# Altium schematic sheet Peripherals.SchDoc
size A3; Author: Ali Zoubir; Organization: ETML-ES; Address1: Avenue Recordon 1; Address2: 1004 Lausanne; Address3: Switzerland; Revision: 1924B; SheetNumber: 3; SheetTotal: 4; Version: V0
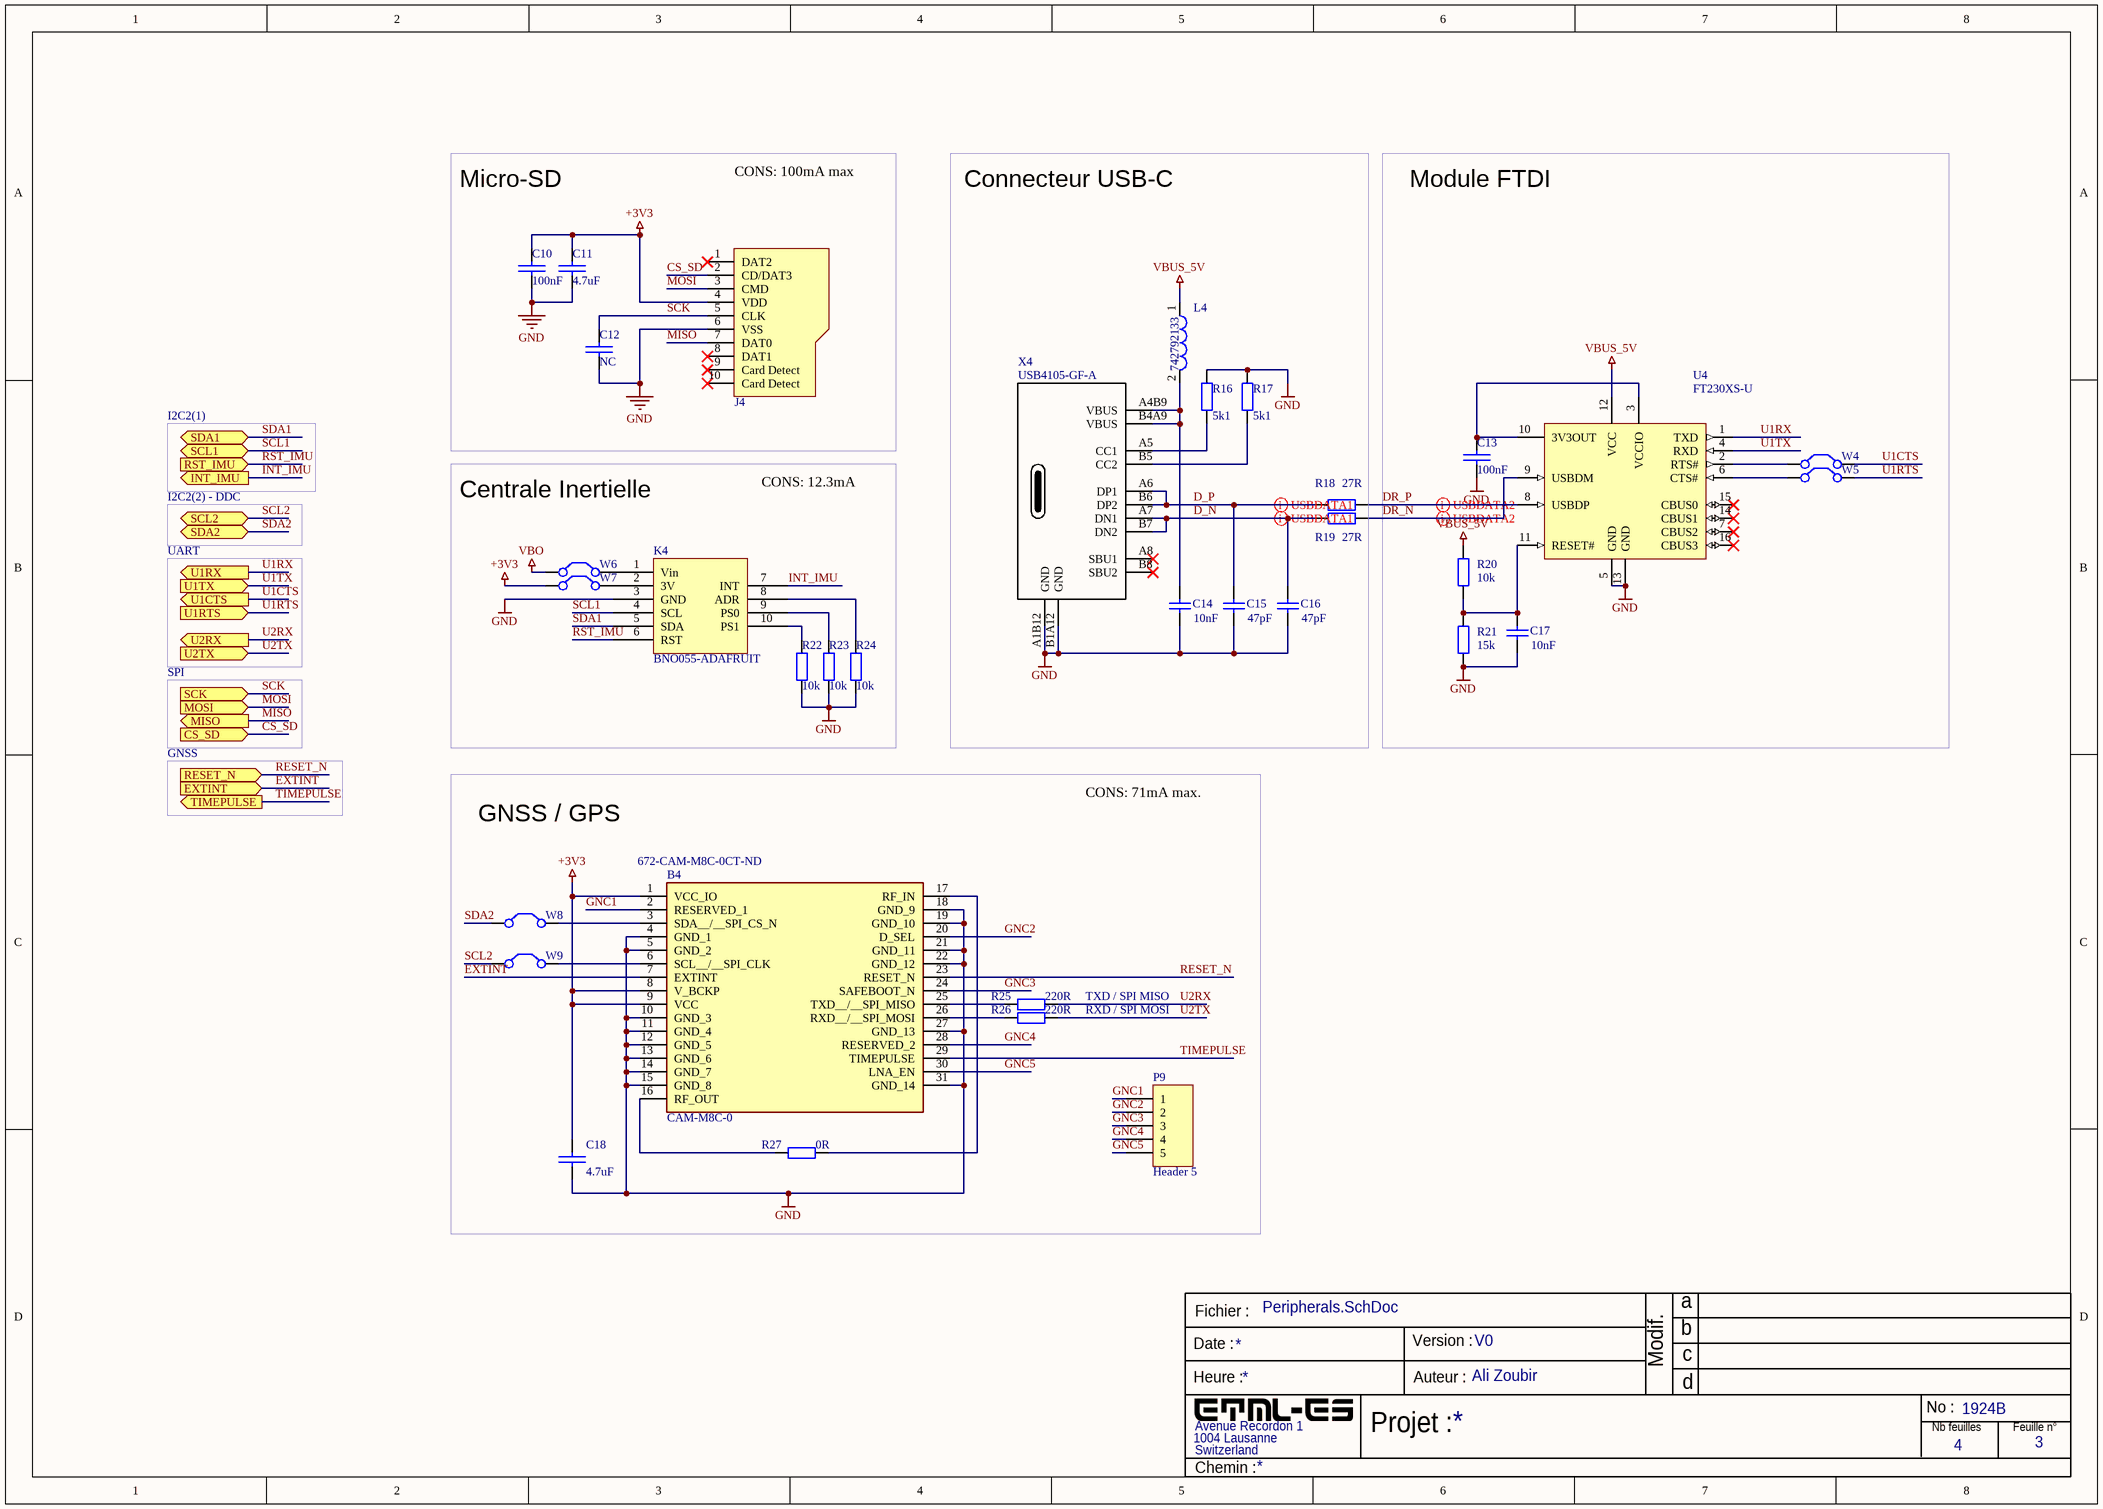
[diagram p0: Peripherals.SchDoc]

## Parts
B4  CAM-M8C-0  Supplier Part Number 1: 672-CAM-M8C-0CT-ND  [CAMM8C0]
C10  100nF  [Cap_0805]
C11  4.7uF  [Cap_0805]
C12  NC  [Cap_0805]
C13  100nF  [Cap_0805]
C14  10nF  [6-0805_L]
C15  47pF  [6-0805_L]
C16  47pF  [6-0805_L]
C17  10nF  [Cap_0805]
C18  4.7uF  [Cap_0805]
J4  693071010811  [uSD-WE-693071010811]  (value not drawn)
K4  BNO055-ADAFRUIT  [BNO055-ADAFRUIT_NO_HOLES]
L4  742792133  [SMD-1206]
P9  Header 5  [HDR1X5]
R16  5k1  [RES_0805]
R17  5k1  [RES_0805]
R18  27R  [RES_0805]
R19  27R  [RES_0805]
R20  10k  [RES_0805]
R21  15k  [RES_0805]
R22  10k  [RES_0805]
R23  10k  [RES_0805]
R24  10k  [RES_0805]
R25  220R  [RES_0805]
R26  220R  [RES_0805]
R27  value 0R  [RES_0805]  (hidden comment: 220R)
U4  FT230XS-U  [SSOP-16_N]
W4  Jumper  [JUMPER]  (value not drawn)
W5  Jumper  [JUMPER]  (value not drawn)
W6  Jumper  [JUMPER]  (value not drawn)
W7  Jumper  [JUMPER]  (value not drawn)
W8  Jumper  [JUMPER]  (value not drawn)
W9  Jumper  [JUMPER]  (value not drawn)
X4  USB4105-GF-A  [GCT_USB4105-GF-A]

## Blocks framed on the sheet
Micro-SD: C10-C12 J4
Connecteur USB-C: C14-C16 L4 R16-R19 X4
Module FTDI: C13 C17 R20 R21 U4 W4 W5
Centrale Inertielle: K4 R22-R24 W6 W7
GNSS / GPS: B4 C18 P9 R25-R27 W8 W9

## Ports
CS_SD (in), EXTINT (in), INT_IMU (out), MISO (out), MOSI (in), RESET_N (in), RST_IMU (in), SCK (in), SCL1 (bidir), SCL2 (bidir), SDA1 (bidir), SDA2 (bidir), TIMEPULSE (out), U1CTS (out), U1RTS (in), U1RX (out), U1TX (in), U2RX (out), U2TX (in)

## Nets
+3V3: B4.1(VCC_IO) B4.8(V_BCKP) B4.9(VCC) C10.1 C11.1 C18.1 J4.4(VDD) W7.1(C1)
GND: B4.4(GND_1) B4.5(GND_2) B4.10(GND_3) B4.11(GND_4) B4.12(GND_5) B4.13(GND_6) B4.14(GND_7) B4.15(GND_8) B4.18(GND_9) B4.19(GND_10) B4.21(GND_11) B4.22(GND_12) B4.27(GND_13) B4.31(GND_14) C10.2 C11.2 C12.2 C13.2 C14.1 C15.1 C16.1 C17.1 C18.2 J4.6(VSS) K4.3(GND) R16.2 R17.2 R21.1 R22.1 R23.1 R24.1 U4.5(GND) U4.13(GND) X4.A1B12(GND) X4.B1A12(GND)
VBO: W6.1(C1)
VBUS_5V: L4.1 R20.2 U4.12(VCC)
CS_SD: J4.2(CD/DAT3) ; port CS_SD
D_N: C16.2 R19.1 X4.A7(DN1) X4.B7(DN2)
D_P: C15.2 R18.1 X4.A6(DP1) X4.B6(DP2)
DR_N: R19.2 U4.9(USBDM)
DR_P: R18.2 U4.8(USBDP)
EXTINT: B4.7(EXTINT) ; port EXTINT
GNC1: B4.2(RESERVED_1) P9.1
GNC2: B4.20(D_SEL) P9.2
GNC3: B4.24(SAFEBOOT_N) P9.3
GNC4: B4.28(RESERVED_2) P9.4
GNC5: B4.30(LNA_EN) P9.5
INT_IMU: K4.7(INT) ; port INT_IMU
MISO: J4.7(DAT0) ; port MISO
MOSI: J4.3(CMD) ; port MOSI
RESET_N: B4.23(RESET_N) ; port RESET_N
RST_IMU: K4.6(RST) ; port RST_IMU
SCK: C12.1 J4.5(CLK) ; port SCK
SCL1: K4.4(SCL) ; port SCL1
SCL2: W9.1(C1) ; port SCL2
SDA1: K4.5(SDA) ; port SDA1
SDA2: W8.1(C1) ; port SDA2
TIMEPULSE: B4.29(TIMEPULSE) ; port TIMEPULSE
U1CTS: W4.2(C2) ; port U1CTS
U1RTS: W5.2(C2) ; port U1RTS
U1RX: U4.1(TXD) ; port U1RX
U1TX: U4.4(RXD) ; port U1TX
U2RX: R25.1 ; port U2RX
U2TX: R26.1 ; port U2TX
NetB4_3: B4.3(SDA__/__SPI_CS_N) W8.2(C2)
NetB4_6: B4.6(SCL__/__SPI_CLK) W9.2(C2)
NetB4_16: B4.16(RF_OUT) R27.2
NetB4_17: B4.17(RF_IN) R27.1
NetB4_25: B4.25(TXD__/__SPI_MISO) R25.2
NetB4_26: B4.26(RXD__/__SPI_MOSI) R26.2
NetC13_1: C13.1 U4.3(VCCIO) U4.10(3V3OUT)
NetC14_2: C14.2 L4.2 X4.A4B9(VBUS) X4.B4A9(VBUS)
NetC17_2: C17.2 R20.1 R21.2 U4.11(RESET#)
NetK4_1: K4.1(Vin) W6.2(C2)
NetK4_2: K4.2(3V) W7.2(C2)
NetK4_8: K4.8(ADR) R24.2
NetK4_9: K4.9(PS0) R23.2
NetK4_10: K4.10(PS1) R22.2
NetR16_1: R16.1 X4.A5(CC1)
NetR17_1: R17.1 X4.B5(CC2)
NetU4_2: U4.2(RTS#) W4.1(C1)
NetU4_6: U4.6(CTS#) W5.1(C1)

Not connected (* = marked no-connect by the designer): J4 1(DAT2)* 8(DAT1)* 9(Card_Detect)* 10(Card_Detect)*; U4 7(CBUS2)* 14(CBUS1)* 15(CBUS0)* 16(CBUS3)*; X4 A8(SBU1)* B8(SBU2)*

## Layout directives
differential pair: D_N, D_P, DR_N, DR_P

## Notes on the sheet
- CONS: 100mA max
- I2C2(1)
- I2C2(2) - DDC
- CONS: 12.3mA
- UART
- SPI
- GNSS
- CONS: 71mA max.
- TXD / SPI MISO
- RXD / SPI MOSI
- Fichier :
- a
- Date :
- Heure :
- Version :
- Auteur :
- Modif.
- b
- c
- d
- Projet :
- No :
- Nb feuilles
- Feuille n°
- Chemin :

## Library data of the parts
B4 = CAM-M8C-0: RF RCVR GNSS/GPS 1.575GHZ MODULE; Manufacturer_Name: U-Blox; Geometry.Height: 2.3mm; Manufacturer_Part_Number: CAM-M8C-0; Mouser Part Number: 377-CAM-M8C-0; Mouser Price/Stock: https://www.mouser.co.uk/ProductDetail/u-blox/CAM-M8C-0?qs=vEM7xhTegWh0Qdx4vzEerw%3D%3D; Arrow Part Number: *; Arrow Price/Stock: *; Datasheet Link: https://www.mouser.cn/ProductDetail/u-blox/CAM-M8C-0?qs=%2Fha2pyFadui7ZmsGRBrJBt%252BuEsnOsR2xV%252BdWTisaE9ttYO2aX8ol3A%3D%3D; Supplier 1: Digi-Key
C10-C13 C18 = C: SDTSourceLibName: C:\WINDOWS\TEMP\DA.LIB; PCB Footprint: RC0805
C14-C17 = Cap: Capacitor; Published: 8-Jun-2000; LatestRevisionDate: 17-Jul-2002; LatestRevisionNote: Re-released for DXP Platform.; PackageReference: RAD-0.3; Publisher: Altium Limited; PackageDescription: Radial Cap, Thru-Hole; 2 Leads; 0.3 in Pin Spacing
  C14 C17: Value: 10nF
  C15 C16: Value: 47pF
J4 = uSD-WE-693071010811: WR-CRD Micro SD Card Connector Push & Push; Manufacturer: Wurth Elektronik; Contact Resistance: 100mOhm; Gender: Socket; Rated Current: 0.5A; Working Voltage: 100VAC; Withstanding Voltage: 500VAC; Manufacturer Part Number: 693071010811; Category: Input/Output Connectors; Match Code: WR-CRD; ComponentLink1Description: Website Link; ComponentLink1URL: https://www.we-online.com/redexpert/article/693071010811?ad; ComponentLink2Description: Datasheet Link; ComponentLink2URL: https://www.we-online.com/redexpert/spec/693071010811?ad; Mount: Surface Mount; Operating Temperature Max: 85°C; Operating Temperature Min: -25°C; Packaging: Tape and Reel; Number of Pins: 8; Type: Push & Push
L4 = CMP-0220-00010-1: SMD EMI Suppression Ferrite Bead WE-CBF, Z = 600 Ohm; Impedance: 600 Ohm; ComponentLink1Description: Manufacturer Link; DatasheetVersion: ver 2, Aug-2007; ComponentLink1URL: http://www.we-online.com; PackageDescription: Chip Inductor, 2-Leads, Body 3.2 x 1.6 mm; ComponentLink2URL: http://www.we-online.de/katalog/media/pdf/742792133.pdf; PackageVersion: 2007; PackageReference: SMD-1206; ComponentLink2Description: Datasheet
P9 = Header 5: Header, 5-Pin; LatestRevisionDate: 17-Jul-2002; LatestRevisionNote: Re-released for DXP Platform.; Publisher: Altium Limited
R16-R27 = Res2: Res 0805; Published: 8-Jun-2000; LatestRevisionDate: 17-Jul-2002; LatestRevisionNote: Re-released for DXP Platform.; PackageReference: AXIAL-0.4; Publisher: Altium Limited; PackageDescription: Axial Device, Thru-Hole; 2 Leads; 0.4 in Pin Spacing
  R16 R17: Value: 5k1
  R18 R19: Value: 27R
  R20 R22-R24: Value: 10k
  R21: Value: 15k
  R25 R26: Value: 220R
U4 = CMP-0248-00025-2: USB to Basic UART Interface Chip, UHCI/OHCI/EHCI Compatible, USB 2.0 Compatible, -40 to +85 degC, 16-Pin SSOP, Pb-Free, Tube; Manufacturer: FTDI; PackageDescription: 16-Pin Small Outline Package, 8.6 x 3.9 mm Body, 0.635 mm Pitch; ComponentLink2URL: http://www.ftdichip.com/Support/Documents/DataSheets/ICs/DS_FT230X.pdf; ComponentLink3URL: www.ftdichip.com/Products/ICs/FT230X.html; PartNumber: FT230XS-U; RevisionNote: DatasheetVersion updated to 1.2 Feb-2013; PackageVersion: Feb-13; ComponentLink2Description: Datasheet; Code_JEDEC: MO-137-AB; DatasheetVersion: ver 1.2, Feb-2013; ComponentLink1URL: http://www.ftdichip.com/; PackageReference: SSOP-16; ComponentLink1Description: Manufacturer URL; ComponentLink3Description: FT230X Product Page
W4-W9 = Jumper: Jumper Wire; Published: 24-Mar-1999; LatestRevisionDate: 17-Jul-2002; LatestRevisionNote: Re-released for DXP Platform.; PackageReference: RAD-0.2; Publisher: Altium Limited; PackageDescription: Radial Cap, Thru-Hole; 2 Leads; 0.2 in Pin Spacing
X4 = USB-C Type 2.0: USB4105-GF-A USB connector; ComponentLink1Description: LCSC  C319148; ComponentLink1URL: https://lcsc.com/product-detail/USB-Connectors_XKB-Connectivity-U262-161N-4BVC11_C319148.html; Supplier 1: LCSC; Supplier Part Number 1: C319148